# Altium project PCB_Abanico_MkI.PrjPcb
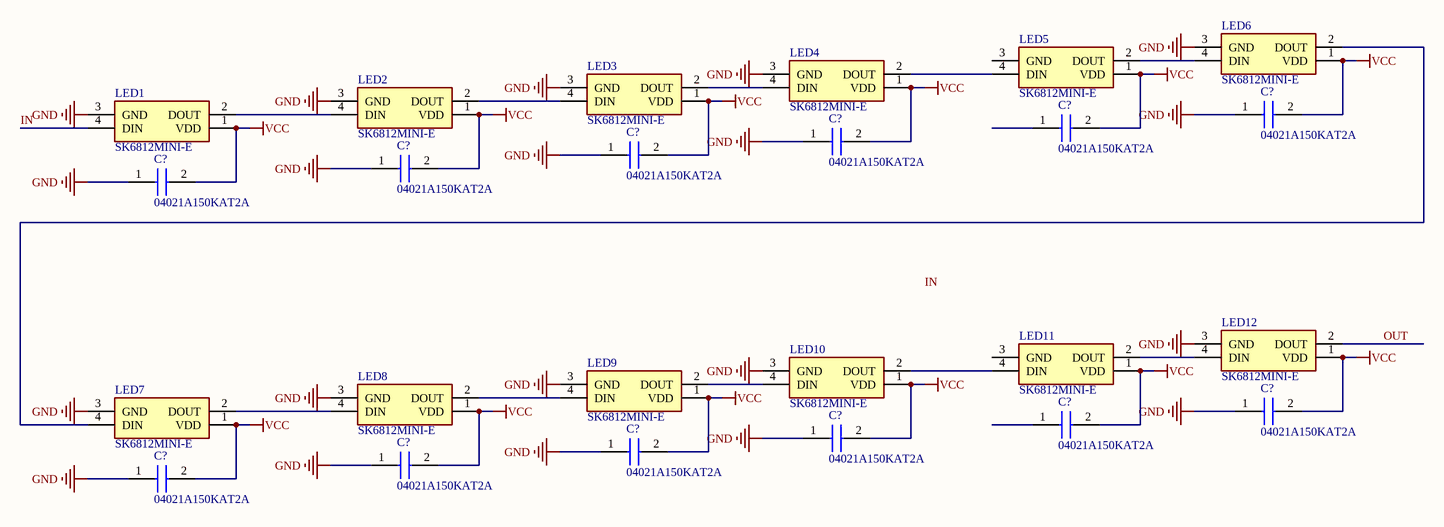
[diagram p0: PCB-Abanico-MkI.SchDoc]
1 sheet, 24 parts. Net scope: global (net labels, ports and power ports of the same name join across sheets).
Board file: PCB-Abanico-MkI.PcbDoc

## Sheet PCB-Abanico-MkI.SchDoc
size A4; SheetNumber: 1; SheetTotal: 1

### Parts
(Parts that share a designator on the sheet are numbered #1, #2 ... from top to bottom, then left to right.)
C?#1  04021A150KAT2A  [CAPC1005X56N]
C?#2  04021A150KAT2A  [CAPC1005X56N]
C?#3  04021A150KAT2A  [CAPC1005X56N]
C?#4  04021A150KAT2A  [CAPC1005X56N]
C?#5  04021A150KAT2A  [CAPC1005X56N]
C?#6  04021A150KAT2A  [CAPC1005X56N]
C?#7  04021A150KAT2A  [CAPC1005X56N]
C?#8  04021A150KAT2A  [CAPC1005X56N]
C?#9  04021A150KAT2A  [CAPC1005X56N]
C?#10  04021A150KAT2A  [CAPC1005X56N]
C?#11  04021A150KAT2A  [CAPC1005X56N]
C?#12  04021A150KAT2A  [CAPC1005X56N]
LED1  SK6812MINI-E  [SK6812MINIE]
LED2  SK6812MINI-E  [SK6812MINIE]
LED3  SK6812MINI-E  [SK6812MINIE]
LED4  SK6812MINI-E  [SK6812MINIE]
LED5  SK6812MINI-E  [SK6812MINIE]
LED6  SK6812MINI-E  [SK6812MINIE]
LED7  SK6812MINI-E  [SK6812MINIE]
LED8  SK6812MINI-E  [SK6812MINIE]
LED9  SK6812MINI-E  [SK6812MINIE]
LED10  SK6812MINI-E  [SK6812MINIE]
LED11  SK6812MINI-E  [SK6812MINIE]
LED12  SK6812MINI-E  [SK6812MINIE]

### Nets
GND: C?#1.1 C?#3.1 C?#4.1 C?#5.1 C?#6.1 C?#7.1 C?#9.1 C?#10.1 C?#11.1 C?#12.1 LED1.3(GND) LED2.3(GND) LED3.3(GND) LED4.3(GND) LED6.3(GND) LED7.3(GND) LED8.3(GND) LED9.3(GND) LED10.3(GND) LED12.3(GND)
VCC: C?#1.2 C?#2.2 C?#3.2 C?#4.2 C?#5.2 C?#6.2 C?#7.2 C?#8.2 C?#9.2 C?#10.2 C?#11.2 C?#12.2 LED1.1(VDD) LED2.1(VDD) LED3.1(VDD) LED4.1(VDD) LED5.1(VDD) LED6.1(VDD) LED7.1(VDD) LED8.1(VDD) LED9.1(VDD) LED10.1(VDD) LED11.1(VDD) LED12.1(VDD)
IN: LED1.4(DIN)
OUT: LED12.2(DOUT)
NetLED1_2: LED1.2(DOUT) LED2.4(DIN)
NetLED2_2: LED2.2(DOUT) LED3.4(DIN)
NetLED3_2: LED3.2(DOUT) LED4.4(DIN)
NetLED4_2: LED4.2(DOUT) LED5.4(DIN)
NetLED5_2: LED5.2(DOUT) LED6.4(DIN)
NetLED6_2: LED6.2(DOUT) LED7.4(DIN)
NetLED7_2: LED7.2(DOUT) LED8.4(DIN)
NetLED8_2: LED8.2(DOUT) LED9.4(DIN)
NetLED9_2: LED9.2(DOUT) LED10.4(DIN)
NetLED10_2: LED10.2(DOUT) LED11.4(DIN)
NetLED11_2: LED11.2(DOUT) LED12.4(DIN)

Not connected (* = marked no-connect by the designer): C?#2 1; C?#8 1; LED5 3(GND); LED11 3(GND)

### Notes on the sheet
- Labels drawn without touching a wire or pin: IN

### Library data of the parts
C?#1-C?#12 = 04021A150KAT2A: Capacitor; Manufacturer_Name: Kyocera AVX; Datasheet Link: http://www.mouser.com/catalog/supplier/library/pdf/AVXSurfaceMountCeramic.pdf; Height: 0.56mm; Manufacturer_Part_Number: 04021A150KAT2A; Mouser Part Number: 581-04021A150KAT2A; Mouser Price/Stock: https://www.mouser.co.uk/ProductDetail/KYOCERA-AVX/04021A150KAT2A?qs=%252BdQmOuGyFcE6A2cgPfRetA%3D%3D
LED1-LED12 = SK6812MINI-E: LED; Manufacturer_Name: Yellow Stone Corp.; Datasheet Link: http://yushakobo.jp/ds/YS-SK6812MINI-E.pdf; Height: 1.88mm; Manufacturer_Part_Number: SK6812MINI-E